# Altium schematic sheet Main.SchDoc
size Tabloid; Author: Martin Lafleur; Organization: Opensolar; Address1: 125 Du Versant; Address2: Saint-Colomban; Address3: Québec, Canada; Address4: J5K 1L9; Website: www.opensolar.io; email: mlafleur@opensolar.io
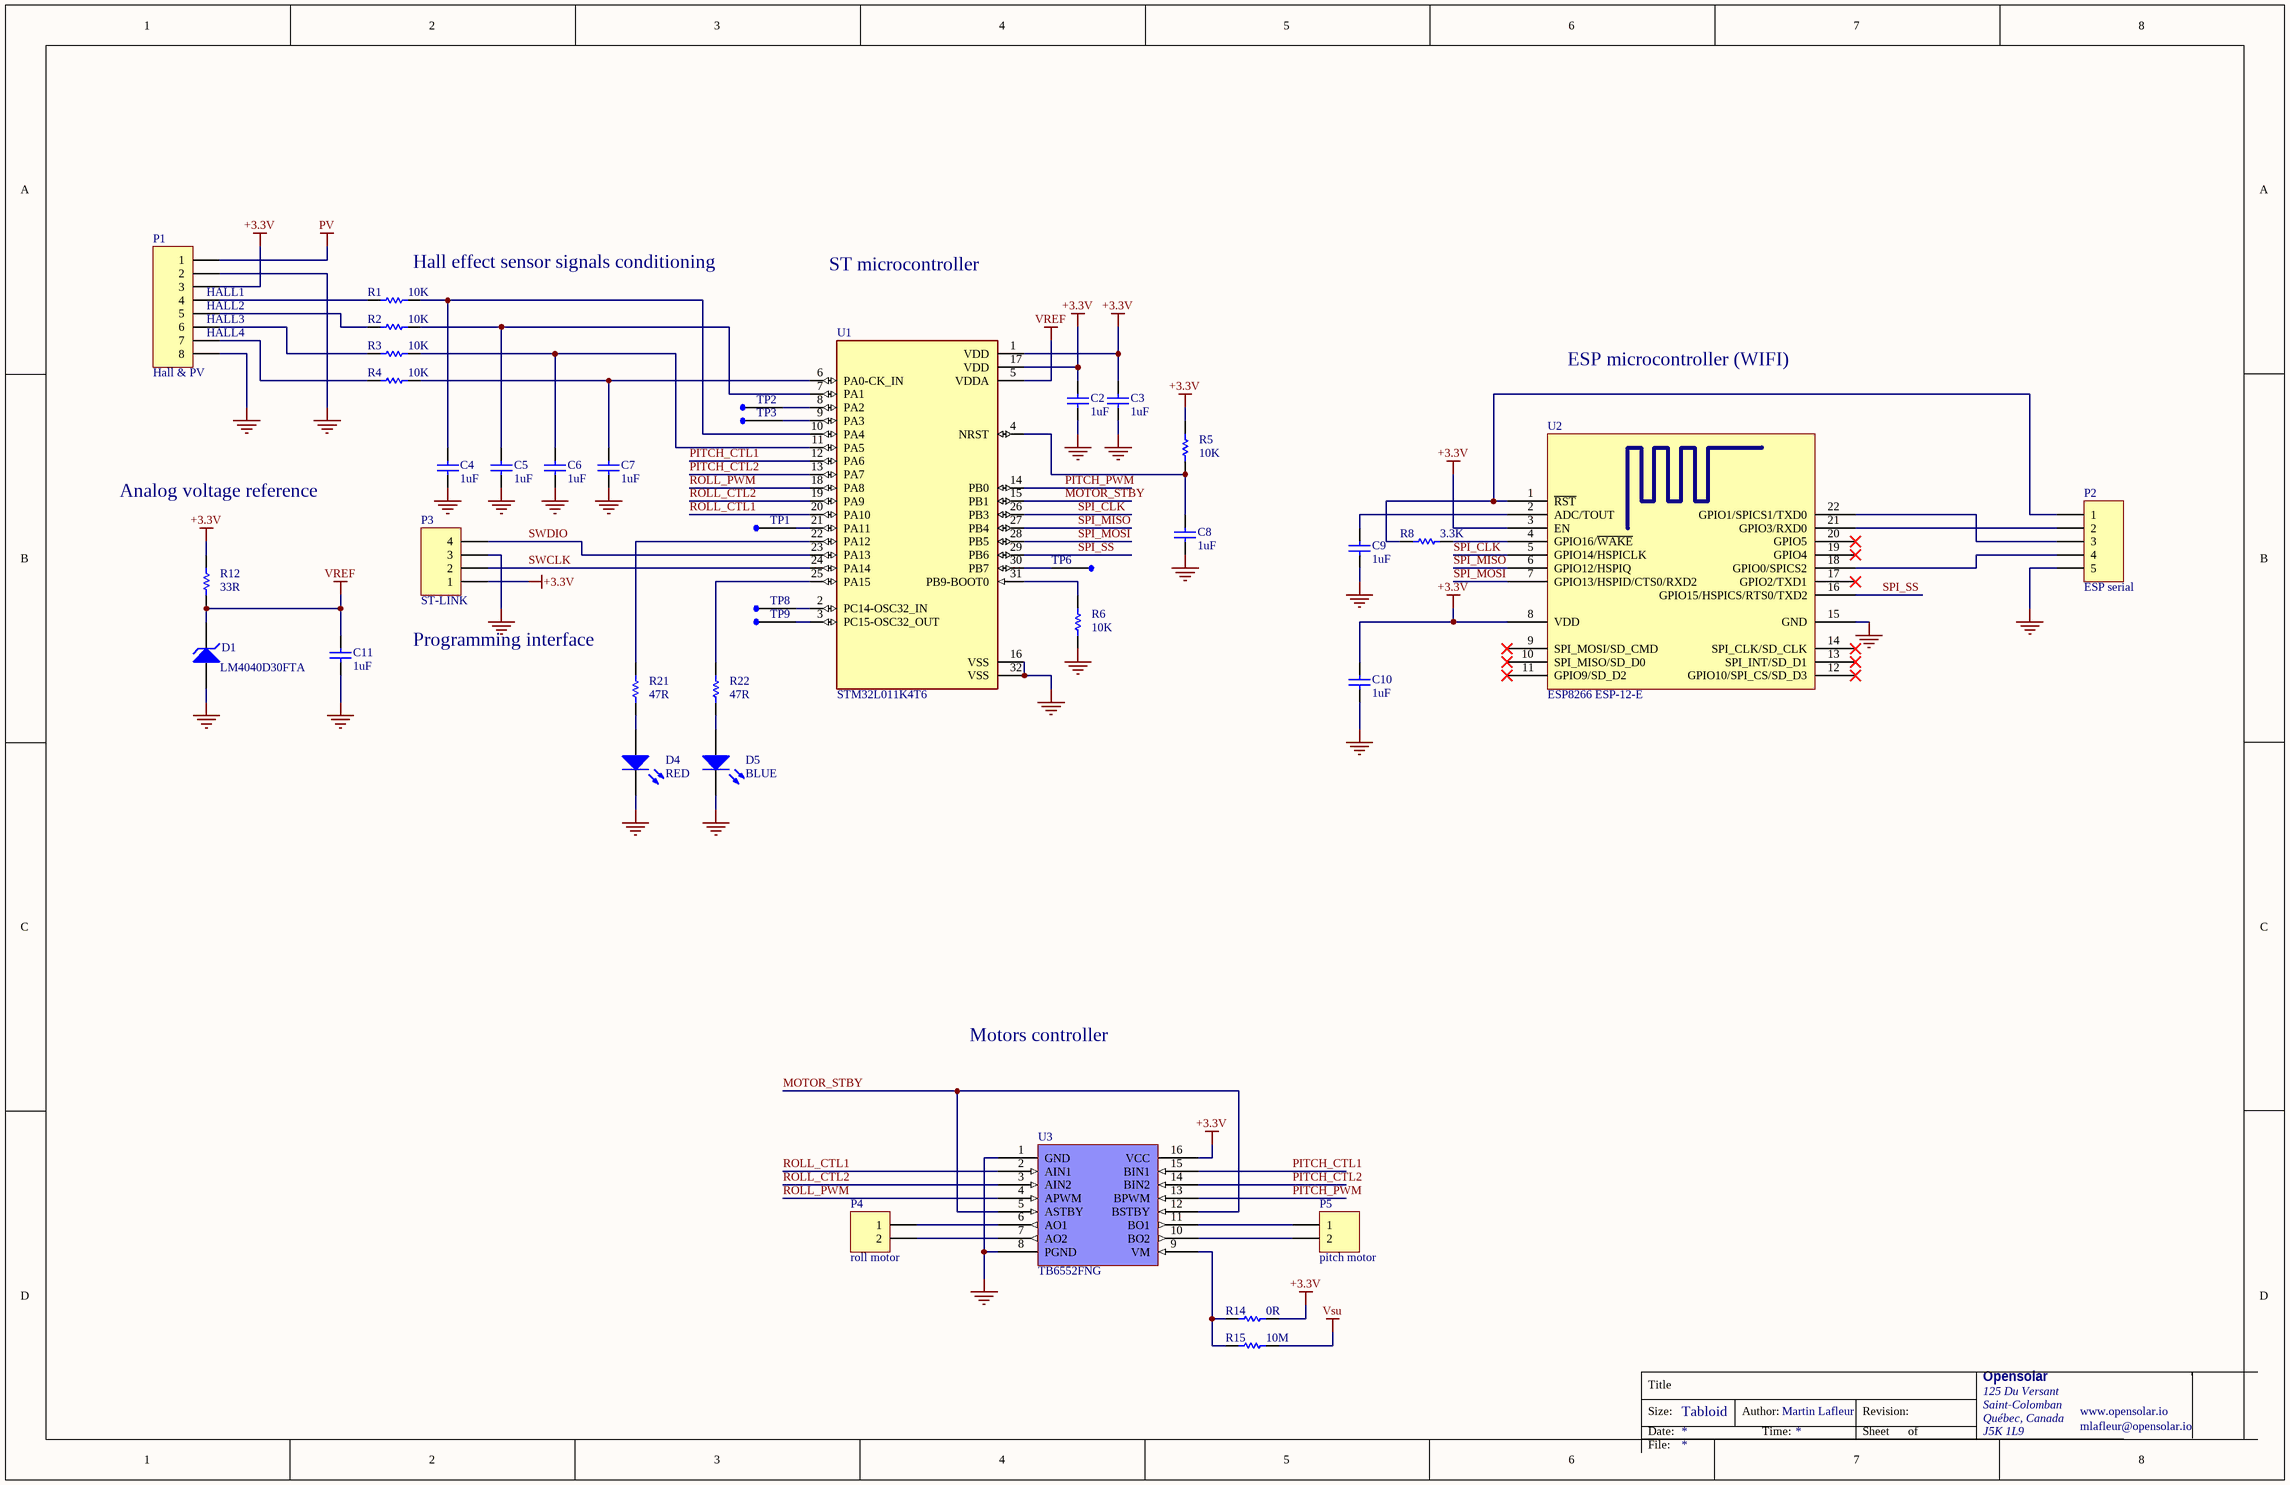
[diagram p0: Main.SchDoc]

## Parts
C2  1uF  [6-0805_M]
C3  1uF  [6-0805_M]
C4  1uF  [6-0805_M]
C5  1uF  [6-0805_M]
C6  1uF  [6-0805_M]
C7  1uF  [6-0805_M]
C8  1uF  [6-0805_M]
C9  1uF  [6-0805_M]
C10  1uF  [6-0805_M]
C11  1uF  [6-0805_M]
D1  LM4040D30FTA  [SOT23_LM4040]
D4  RED  [6-0805_M]
D5  BLUE  [6-0805_M]
P1  Hall & PV  [FFC_8]
P2  ESP serial  [HEADER-1X5]
P3  ST-LINK  [HEADER-1X4]
P4  roll motor  [HEADER-1X2]
P5  pitch motor  [HEADER-1X2]
R1  10K  [6-0805_N]
R2  10K  [6-0805_N]
R3  10K  [6-0805_N]
R4  10K  [6-0805_N]
R5  10K  [6-0805_N]
R6  10K  [6-0805_N]
R8  3.3K  [6-0805_N]
R12  33R  [6-0805_N]
R14  0R  [6-0805_N]
R15  10M  [6-0805_N]
R21  47R  [6-0805_N]
R22  47R  [6-0805_N]
TP1  TEST_POINT  [TEST_POINT_PAD]  (value not drawn)
TP2  TEST_POINT  [TEST_POINT_PAD]  (value not drawn)
TP3  TEST_POINT  [TEST_POINT_PAD]  (value not drawn)
TP6  TEST_POINT  [TEST_POINT_PAD]  (value not drawn)
TP8  TEST_POINT  [TEST_POINT_PAD]  (value not drawn)
TP9  TEST_POINT  [TEST_POINT_PAD]  (value not drawn)
U1  STM32L011K4T6  [QFP80P900X900X160-32N]
U2  ESP8266 ESP-12-E  [ESP8266 ESP-12-E]
U3  TB6552FNG  [SSOP16_TB6652]

## Nets
+3.3V: C2.2 C3.2 C10.2 P1.3 P3.1 R5.1 R12.2 R14.2 U1.1(VDD) U1.17(VDD) U2.3(EN) U2.8(VDD) U3.16(VCC)
GND: C2.1 C3.1 C4.1 C5.1 C6.1 C7.1 C8.1 C9.1 C10.1 C11.1 D1.1(A) D4.2(K) D5.2(K) P1.2 P1.8 P2.5 P3.3 R6.1 U1.16(VSS) U1.32(VSS) U2.15(GND) U3.1(GND) U3.8(PGND)
PV: P1.1
VREF: C11.2 D1.2(K) R12.1 U1.5(VDDA)
Vsu: R15.2
MOTOR_STBY: U1.15(PB1) U3.5(ASTBY) U3.12(BSTBY)
PITCH_CTL1: U1.12(PA6) U3.15(BIN1)
PITCH_CTL2: U1.13(PA7) U3.14(BIN2)
PITCH_PWM: U1.14(PB0) U3.13(BPWM)
ROLL_CTL1: U1.20(PA10) U3.2(AIN1)
ROLL_CTL2: U1.19(PA9) U3.3(AIN2)
ROLL_PWM: U1.18(PA8) U3.4(APWM)
SPI_CLK: U1.26(PB3) U2.5(GPIO14/HSPICLK)
SPI_MISO: U1.27(PB4) U2.6(GPIO12/HSPIQ)
SPI_MOSI: U1.28(PB5) U2.7(GPIO13/HSPID/CTS0/RXD2)
SPI_SS: U1.29(PB6) U2.16(GPIO15/HSPICS/RTS0/TXD2)
SWCLK: P3.2 U1.24(PA14)
SWDIO: P3.4 U1.23(PA13)
NetC4_2: C4.2 R1.1 U1.10(PA4)
NetC5_2: C5.2 R2.1 U1.7(PA1)
NetC6_2: C6.2 R3.1 U1.11(PA5)
NetC7_2: C7.2 R4.1 U1.6(PA0-CK_IN)
NetC8_2: C8.2 R5.2 U1.4(NRST)
NetC9_2: C9.2 U2.2(ADC/TOUT)
NetD4_1: D4.1(A) R21.1
NetD5_1: D5.1(A) R22.1
NetP1_4: P1.4 R1.2
NetP1_5: P1.5 R2.2
NetP1_6: P1.6 R3.2
NetP1_7: P1.7 R4.2
NetP2_1: P2.1 R8.1 U2.1(~{RST})
NetP2_2: P2.2 U2.21(GPIO3/RXD0)
NetP2_3: P2.3 U2.22(GPIO1/SPICS1/TXD0)
NetP2_4: P2.4 U2.18(GPIO0/SPICS2)
NetP4_1: P4.1 U3.6(AO1)
NetP4_2: P4.2 U3.7(AO2)
NetP5_1: P5.1 U3.11(BO1)
NetP5_2: P5.2 U3.10(BO2)
NetR6_2: R6.2 U1.31(PB9-BOOT0)
NetR8_2: R8.2 U2.4(GPIO16/~{WAKE})
NetR14_1: R14.1 R15.1 U3.9(VM)
NetR21_2: R21.2 U1.22(PA12)
NetR22_2: R22.2 U1.25(PA15)
NetTP1_1: TP1.1 U1.21(PA11)
NetTP2_1: TP2.1 U1.8(PA2)
NetTP3_1: TP3.1 U1.9(PA3)
NetTP6_1: TP6.1 U1.30(PB7)
NetTP8_1: TP8.1 U1.2(PC14-OSC32_IN)
NetTP9_1: TP9.1 U1.3(PC15-OSC32_OUT)

Not connected (* = marked no-connect by the designer): U2 9(SPI_MOSI/SD_CMD)* 10(SPI_MISO/SD_D0)* 11(GPIO9/SD_D2)* 12(GPIO10/SPI_CS/SD_D3)* 13(SPI_INT/SD_D1)* 14(SPI_CLK/SD_CLK)* 17(GPIO2/TXD1)* 19(GPIO4)* 20(GPIO5)*

## Notes on the sheet
- (near P1) HALL1
- (near R1) Hall effect sensor signals conditioning
- ST microcontroller
- (near P1) HALL2
- (near P1) HALL3
- (near P1) HALL4
- ESP microcontroller (WIFI)
- Analog voltage reference
- Programming interface
- Motors controller
- Title
- Size:
- Date:
- Tabloid
- Author:
- Time:
- Revision:
- Sheet
- of
- File:

## Library data of the parts
C2-C11 = Cap: Capacitor; Published: 8-Jun-2000; LatestRevisionDate: 17-Jul-2002; LatestRevisionNote: Re-released for DXP Platform.; PackageReference: RAD-0.3; Publisher: Altium Limited; PackageDescription: Radial Cap, Thru-Hole; 2 Leads; 0.3 in Pin Spacing; Value: 1uF; jlc: C28323
D1 = D Zener: Zener Diode; Published: 8-Jun-2000; LatestRevisionDate: 17-Jul-2002; LatestRevisionNote: Re-released for DXP Platform.; PackageReference: DIODE-0.7; Publisher: Altium Limited; PackageDescription: Diode, Thru-Hole; 2 Leads; 0.7 in Pin Spacing
D4 D5 = LED2: Typical RED, GREEN, YELLOW, AMBER GaAs LED; Published: 8-Jun-2000; LatestRevisionDate: 17-Jul-2002; LatestRevisionNote: Re-released for DXP Platform.; PackageVersion: Feb-2002; PackageReference: 3.2X1.6X1.1; Publisher: Altium Limited; PackageDescription: SM LED; 2 Flat Leads
  D4: jlc: C72037
  D5: jlc: C72035
P1 = Header 8: Header, 8-Pin; LatestRevisionDate: 17-Jul-2002; LatestRevisionNote: Re-released for DXP Platform.; Publisher: Altium Limited
P2 = Header 5: Header, 5-Pin; LatestRevisionDate: 17-Jul-2002; LatestRevisionNote: Re-released for DXP Platform.; Publisher: Altium Limited
P3 = Header 4: Header, 4-Pin; LatestRevisionDate: 17-Jul-2002; LatestRevisionNote: Re-released for DXP Platform.; Publisher: Altium Limited
P4 P5 = Header 2: Header, 2-Pin; LatestRevisionDate: 17-Jul-2002; LatestRevisionNote: Re-released for DXP Platform.; Publisher: Altium Limited
R1-R6 R8 R12 R14 R21 R22 = Res1: Resistor; Published: 8-Jun-2000; LatestRevisionDate: 17-Jul-2002; LatestRevisionNote: Re-released for DXP Platform.; PackageReference: AXIAL-0.3; Publisher: Altium Limited; PackageDescription: Axial Device, Thru-Hole; 2 Leads; 0.3 in Pin Spacing
  R1-R6: Value: 10K; jlc: C17414
  R8: Value: 3.3K; jlc: C26010
  R12: Value: 33R; jlc: C17634
  R14: Value: 0R; jlc: C17477
  R21 R22: Value: 47R; jlc: C17714
R15 = Res1: Resistor; Value: 0R; Published: 8-Jun-2000; LatestRevisionDate: 17-Jul-2002; LatestRevisionNote: Re-released for DXP Platform.; PackageReference: AXIAL-0.3; Publisher: Altium Limited; PackageDescription: Axial Device, Thru-Hole; 2 Leads; 0.3 in Pin Spacing; jlc: C26108
U1 = STM32L011K4T6: ARMÂ® CortexÂ®-M0 + STM32L0 Microcontrolador IC de 32 bits 32MHz 16KB _16K x 8_ FLASH 32-LQFP _7x7_; MF: STMicroelectronics; MP: STM32L011K4T6; SnapEDA_Link: https://www.snapeda.com/parts/STM32L011K4T6/STMicroelectronics/view-part/491202/?ref=snap; Availability: Unavailable; Package: LQFP-32 STMicroelectronics; Price: None; Value: *; jlc: C87904
U3 = TB6652PNG